# EAGLE design tiny85-uvlp-hw (EAGLE 7.3.0)
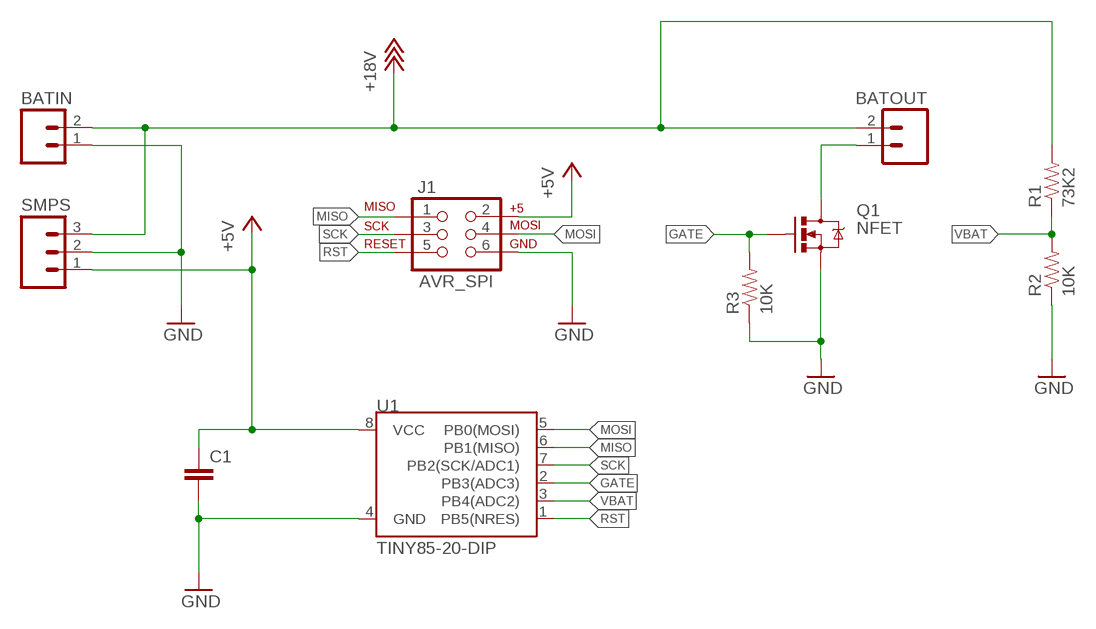
[diagram p0: schematic, sheet 1]

## Parts
BATIN  M02PTH3  [1X02_LONGPADS]
BATOUT  M02PTH3  [1X02_LONGPADS]
C1  0.1UF-50V-20%(PTH)KIT-EZ  [CAP-PTH-SMALL-KIT]
J1  AVR_SPI  AVR_SPI_PRG_6PTH  [2X3]
Q1  NFET  MOSFET-NCHANNELFQP30N06L  [TO220V]
R1  73K2  RESISTORAXIAL-0.3  [AXIAL-0.3]
R2  10K  RESISTORAXIAL-0.3  [AXIAL-0.3]
R3  10K  RESISTORAXIAL-0.3  [AXIAL-0.3]
SMPS  M03LONGPADS  [1X03_LONGPADS]
U1  TINY85-20-DIP  ATTINY45TINY85-20-DIP  [DIP08]

## Nets
+5V: C1.1 J1.2 SMPS.1 U1.8(VCC)
+18V: BATIN.2 BATOUT.2 R1.P$2 SMPS.3
GATE: Q1.1(G) R3.P$2 U1.2(PB3(ADC3))
GND: BATIN.1 C1.2 J1.6 Q1.3(S) R2.P$1 R3.P$1 SMPS.2 U1.4(GND)
GNDOUT: BATOUT.1 Q1.2(D)
MISO: J1.1 U1.6(PB1(MISO))
MOSI: J1.4 U1.5(PB0(MOSI))
RST: J1.5 U1.1(PB5(NRES))
SCK: J1.3 U1.7(PB2(SCK/ADC1))
VBAT: R1.P$1 R2.P$2 U1.3(PB4(ADC2))

## Library data of the parts
BATIN BATOUT = SparkFun-Connectors:M02: Standard 2-pin 0.1" header. Use with - straight break away headers ( PRT-00116) - right angle break away headers (PRT-00553) - swiss pins (PRT-00743) - machine pins (PRT-00117) - female headers (PRT-00115) Molex polarized connector foot print use with: PRT-08233 with associated crimp pins and housings. 2.54_SCREWTERM for use with PRT-10571. 3.5mm Screw Terminal footprints for PRT-08084 5mm Screw Terminal footprints for use with PRT-08432
C1 = SparkFun-Capacitors:0.1UF-50V-20%(PTH): CAP-08370; PROD_ID: CAP-08370
J1 = SparkFun-Connectors:AVR_SPI_PRG_6: AVR ISP 6 Pin This is the reduced ISP connector for AVR programming. Common on Arduino. This footprint will take up less PCB space and can be used with a 10-pin to 6-pin adapter such as SKU: BOB-08508 **Special note about "TEST_POINT" package. The stop mask is on the top side, so if you want your programming test points to be on the bottom of your board, make sure to place this package on the bottom side of the board. This also ensure that the orientation to program from the bottom side will be correct.
Q1 = SparkFun-DiscreteSemi:MOSFET-NCHANNEL: Common NMOSFET Parts MFG P/N Store ID Prod ID FDD8780 TRANS-09984 SI7820DN TRANS-11055 FDS6630A IC-08089 2N7002PW TRANS-11151 FQP30N06L COM-10213 TRANS-10060 BSS123LT1G TRANS-08345 BSS138 TRANS-00830 BS170 2N7000; PROD_ID: TRANS-10060
R1-R3 = SparkFun-Passives:RESISTOR: Resistor Basic schematic elements and footprints for 0603, 1206, and PTH resistors.
SMPS = SparkFun-Connectors:M03: Header 3 Standard 3-pin 0.1" header. Use with straight break away headers (SKU : PRT-00116), right angle break away headers (PRT-00553), swiss pins (PRT-00743), machine pins (PRT-00117), and female headers (PRT-00115). Molex polarized connector foot print use with SKU : PRT-08232 with associated crimp pins and housings.
U1 = SparkFun-DigitalIC:ATTINY45: Atmel 8-pin 2/4/8kB flash uC; PROD_ID: IC-09445

## Board
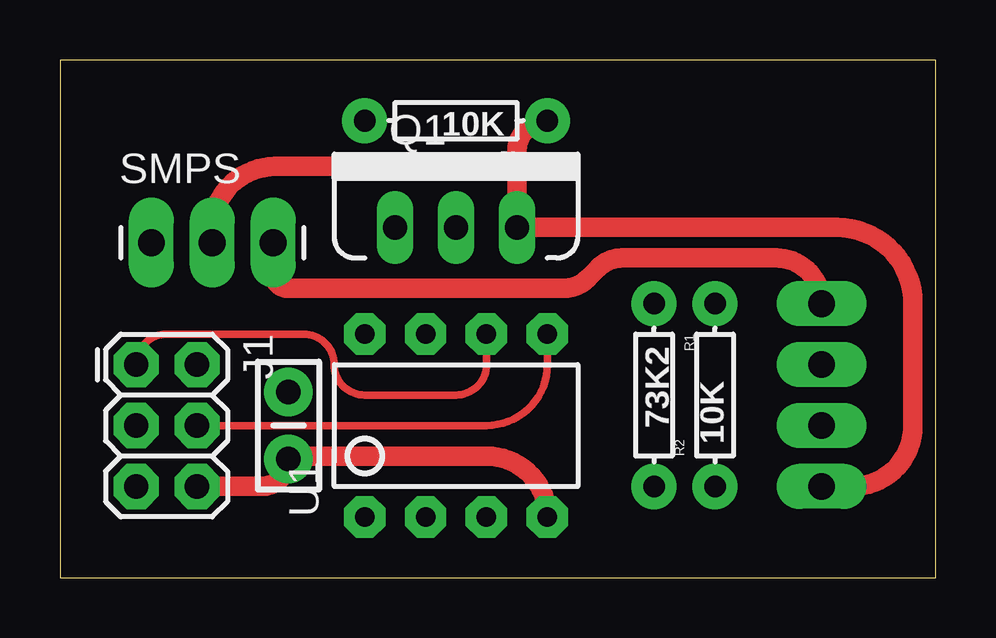
[diagram p1: board, top side]
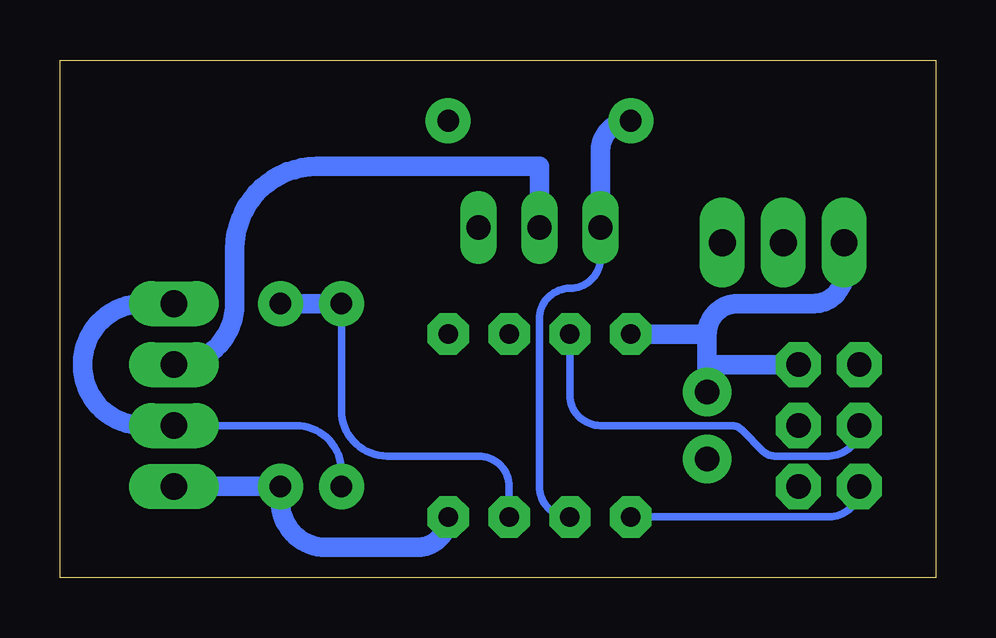
[diagram p2: board, bottom side, seen from below]

Size 36.5 x 21.58 mm. Coordinates in mm from the lower left corner, seen from the top.
Outline: 0,0 36.5,0 36.5,21.58 0,21.58 0,0
Copper layers (1*16): Top 0.035mm / dielectric 1.5mm / Bottom 0.035mm
Design rules "default": minimum track width 10mil, minimum drill 24mil, track to track 8mil, track to pad 8mil, pad to pad 8mil, via to via 8mil, smd to smd 8mil, copper to edge 40mil, drill to drill 8mil, minimum pad ring 10mil, minimum via ring 8mil, stop-mask expansion 4mil, vias tented up to drill 0mil, thermal gap 10mil

### Footprints (pad centres in the part's own frame; a part is rotated, then mirrored left to right if it is on the bottom)
1X02_LONGPADS = drill 1.118 pad 1.88 long: 1 0,0; 2 2.54,0
CAP-PTH-SMALL-KIT = drill 1.016 pad 2.032: 1 -1.397,0; 2 1.397,0
2X3 = drill 1.016 pad 1.88 octagon: 1 0,0; 2 0,2.54; 3 2.54,0; 4 2.54,2.54; 5 5.08,0; 6 5.08,2.54
TO220V = drill 1.016 long: 1 -2.54,0; 2 0,0; 3 2.54,0
AXIAL-0.3 = drill 0.9 pad 1.88: P$1 -3.81,0; P$2 3.81,0
1X03_LONGPADS = drill 1.118 pad 1.88 long: 1 0,0; 2 2.54,0; 3 5.08,0
DIP08 = drill 0.813 pad 1.727 octagon: 1 -3.81,-3.81; 2 -1.27,-3.81; 3 1.27,-3.81; 4 3.81,-3.81; 5 3.81,3.81; 6 1.27,3.81; 7 -1.27,3.81; 8 -3.81,3.81

### Placement (x,y rotation side)
BATIN  31.75,3.81 90 top
BATOUT  31.75,8.89 90 top
C1  9.53,6.35 270 top
J1  3.17,8.89 270 top
Q1  16.51,14.61 0 top
R1  24.77,7.62 270 top
R2  27.3,7.62 90 top
R3  16.51,19.05 180 top
SMPS  3.81,13.97 0 top
U1  16.51,6.35 0 top

### Tracks (layer width: path | path; a pad name or v marks a point on that pad's centre or on a via)
+5V
  Bottom 0.813: U1.8 9.53,10.16 | 9.53,10.16 9.53,8.89 | 9.53,8.89 C1.1 | SMPS.1 3.81,12.7 arc90 5.08,11.43 8.26,11.43 arc-90 9.53,10.16 | J1.2 9.53,8.89
+18V
  Top 0.813: SMPS.3 8.89,12.7 arc90 9.53,12.06 21,12.06 arc45 22.01,12.48 22.44,12.92 arc-45 23.45,13.34 29.84,13.34 arc-90 BATOUT.2
  Bottom 0.305: BATIN.2 26.67,6.35 arc90 24.77,4.45 R1.P$2
  Bottom 0.813: BATOUT.2 33.02,11.43 arc-90 35.56,8.89 arc-90 33.02,6.35 BATIN.2
GATE
  Bottom 0.305: U1.2 arc90 16.51,3.81 16.51,10.79 arc90 15.24,12.06 arc-90 13.97,13.34 Q1.1
  Bottom 0.813: R3.P$2 arc-90 13.97,17.78 Q1.1
GND
  Top 0.813: BATIN.1 33.02,3.81 arc90 35.56,6.35 35.56,11.43 arc90 32.38,14.61 Q1.3 19.05,17.14 | R3.P$1 arc90 19.05,17.78 19.05,17.14 | J1.6 8.38,3.81 arc90 C1.2 9.53,5.08 17.78,5.08 arc-90 U1.4 | SMPS.2 6.35,14.53 arc-90 8.97,17.14 19.05,17.14
  Bottom 0.813: BATIN.1 R2.P$1 27.3,3.17 arc-90 25.4,1.27 21.59,1.27 arc-90 U1.4
GNDOUT
  Bottom 0.813: Q1.2 16.51,17.14 25.79,17.14 arc-90 29.21,13.72 29.21,11.43 arc90 BATOUT.1
MISO
  Top 0.305: J1.1 arc-90 4.45,10.16 10.16,10.16 arc-90 11.43,8.89 arc90 12.7,7.62 16.51,7.62 arc90 17.78,8.89 U1.6
MOSI
  Top 0.305: U1.5 20.32,8.89 arc-90 17.78,6.35 J1.4
RST
  Bottom 0.305: U1.1 4.45,2.54 arc-90 J1.5
SCK
  Bottom 0.305: U1.7 15.24,7.62 arc-90 13.97,6.35 8.52,6.35 arc45 8.07,6.16 7.17,5.27 arc-45 6.72,5.08 4.45,5.08 arc-90 J1.3
VBAT
  Bottom 0.305: U1.3 17.78,3.81 arc-90 19.05,5.08 22.86,5.08 arc90 24.77,6.99 R1.P$1
  Bottom 0.813: R2.P$2 R1.P$1